# Altium schematic sheet OPTICS.SchDoc: XC7A3G-SFP
size A; Date: 9 AUG 2026; Engineer: Parsa Malekpour; Revision: 1.0.0; SheetNumber: 14; SheetTotal: 18
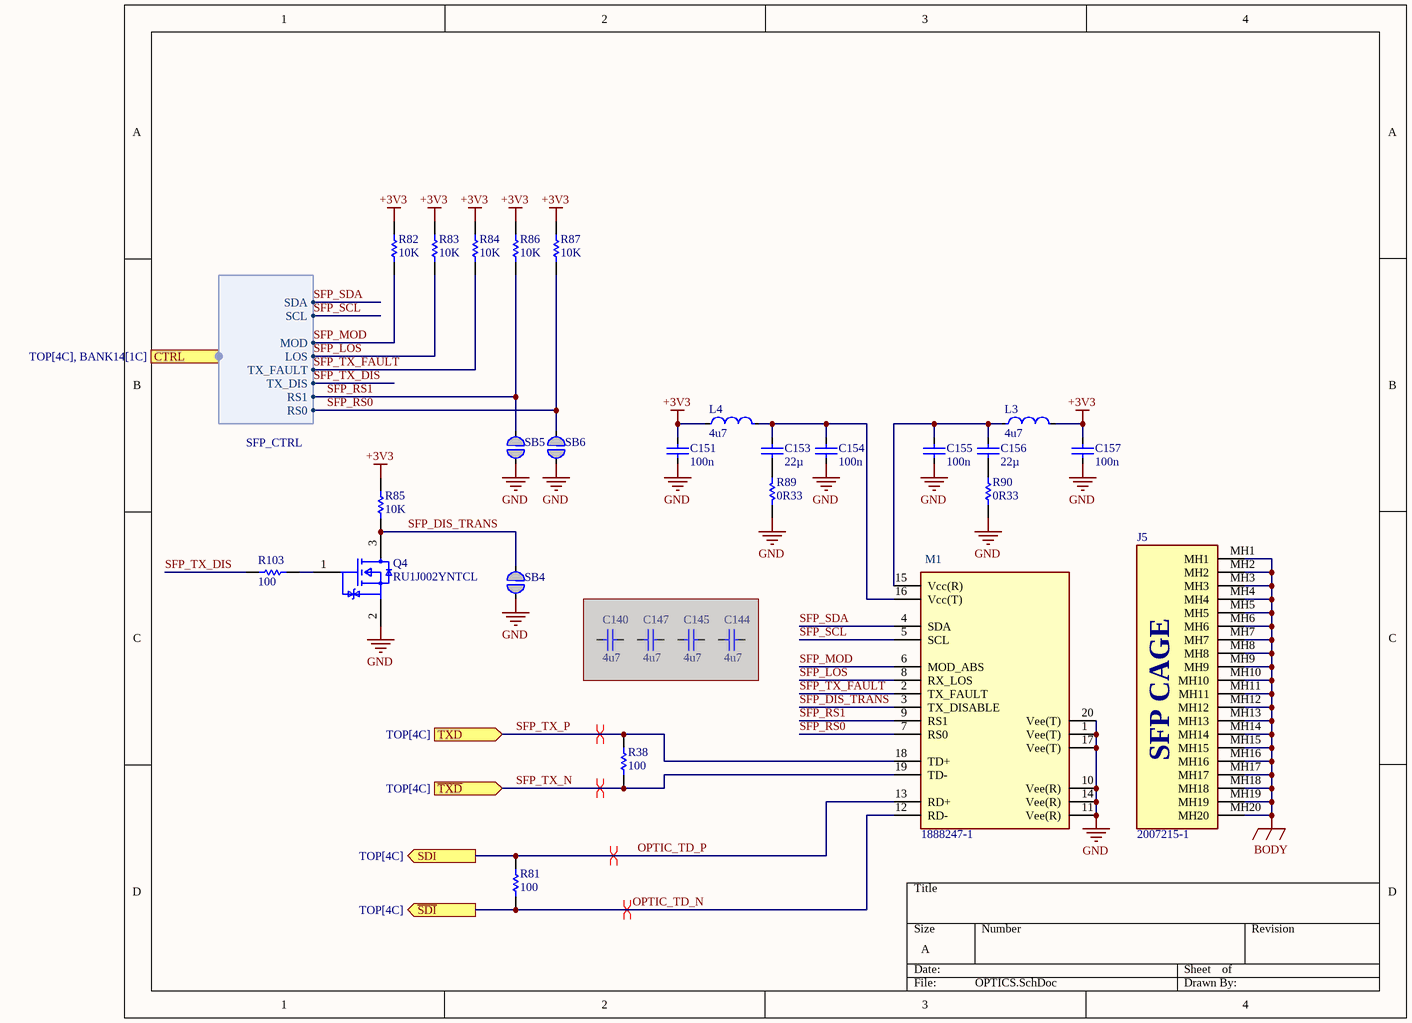
[diagram p0: OPTICS.SchDoc]

## Parts
C140  value 4u7  [FP-C1005-050-0_20-0_10-MFG]  (hidden comment: C1005X5R1A475K050BE)  (masked out: inside a compile mask, not in the netlist)
C144  value 4u7  [FP-C1005-050-0_20-0_10-MFG]  (hidden comment: C1005X5R1A475K050BE)  (masked out: inside a compile mask, not in the netlist)
C145  value 4u7  [FP-C1005-050-0_20-0_10-MFG]  (hidden comment: C1005X5R1A475K050BE)  (masked out: inside a compile mask, not in the netlist)
C147  value 4u7  [FP-C1005-050-0_20-0_10-MFG]  (hidden comment: C1005X5R1A475K050BE)  (masked out: inside a compile mask, not in the netlist)
C151  value 100n  [FP-C1005-050-0_05-IPC_C]  (hidden comment: C1005X7R1H104K050BB)
C153  value 22µ  [CAPC1608X100X20LL10]  (hidden comment: C1608X5R0J226M080AC)
C154  value 100n  [FP-C1005-050-0_05-IPC_C]  (hidden comment: C1005X7R1H104K050BB)
C155  value 100n  [FP-C1005-050-0_05-IPC_C]  (hidden comment: C1005X7R1H104K050BB)
C156  value 22µ  [CAPC1608X100X20LL10]  (hidden comment: C1608X5R0J226M080AC)
C157  value 100n  [FP-C1005-050-0_05-IPC_C]  (hidden comment: C1005X7R1H104K050BB)
J5  2007215-1  [2007215-1]
L3  value 4u7  [FP-DFE252012C-MFG]  (hidden comment: DFE252012P-4R7M=P2)
L4  value 4u7  [FP-DFE252012C-MFG]  (hidden comment: DFE252012P-4R7M=P2)
M1  1888247-1  [1888247-1]
Q4  RU1J002YNTCL  [FP-UMT3F-MFG]
R38  value 100  [RESC1005X40X25LL05T10]  (hidden comment: RC0402FR-07100RL)
R81  value 100  [RESC1005X40X25LL05T10]  (hidden comment: RC0402FR-07100RL)
R82  value 10K  [RESC1005X40X25LL05T10]  (hidden comment: RC0402FR-0710KL)
R83  value 10K  [RESC1005X40X25LL05T10]  (hidden comment: RC0402FR-0710KL)
R84  value 10K  [RESC1005X40X25LL05T10]  (hidden comment: RC0402FR-0710KL)
R85  value 10K  [RESC1005X40X25LL05T10]  (hidden comment: RC0402FR-0710KL)
R86  value 10K  [RESC1005X40X25LL05T10]  (hidden comment: RC0402FR-0710KL)
R87  value 10K  [RESC1005X40X25LL05T10]  (hidden comment: RC0402FR-0710KL)
R89  value 0R33  [RESC1608X55X30LL15T15]  (hidden comment: ERJ-3RQFR33V)
R90  value 0R33  [RESC1608X55X30LL15T15]  (hidden comment: ERJ-3RQFR33V)
R103  value 100  [RESC1005X40X25LL05T10]  (hidden comment: RC0402FR-07100RL)
SB4  Solderbridge  [Solderbridge]  (value not drawn)  (no BOM)
SB5  Solderbridge  [Solderbridge]  (value not drawn)  (no BOM)
SB6  Solderbridge  [Solderbridge]  (value not drawn)  (no BOM)

## Ports
CTRL (harness SFP_CTRL, see TOP[4C], BANK14[1C]), SDI (out, see TOP[4C]), TXD (in, see TOP[4C]), ~{SDI} (out, see TOP[4C]), ~{TXD} (in, see TOP[4C])

## Harnesses
SFP_CTRL: RS0, RS1, TX_DIS, TX_FAULT, LOS, MOD, SCL, SDA

## Nets
+3V3: C151.2 C157.2 L3.2 L4.2 R82.1 R83.1 R84.1 R85.2 R86.1 R87.1
BODY: J5.MH1 J5.MH2 J5.MH3 J5.MH4 J5.MH5 J5.MH6 J5.MH7 J5.MH8 J5.MH9 J5.MH10 J5.MH11 J5.MH12 J5.MH13 J5.MH14 J5.MH15 J5.MH16 J5.MH17 J5.MH18 J5.MH19 J5.MH20
GND: C151.1 C154.1 C155.1 C157.1 M1.1(Vee(T)) M1.10(Vee(R)) M1.11(Vee(R)) M1.14(Vee(R)) M1.17(Vee(T)) M1.20(Vee(T)) Q4.2(S) R89.2 R90.1 SB4.2 SB5.2 SB6.2
OPTIC_TD_N: M1.12(RD-) R81.2 ; port ~{SDI}
OPTIC_TD_P: M1.13(RD+) R81.1 ; port SDI
SFP_DIS_TRANS: M1.3(TX_DISABLE) Q4.3(D) R85.1 SB4.1
SFP_LOS: M1.8(RX_LOS) R83.2 ; port CTRL.LOS
SFP_MOD: M1.6(MOD_ABS) R82.2 ; port CTRL.MOD
SFP_RS0: M1.7(RS0) R87.2 SB6.1 ; port CTRL.RS0
SFP_RS1: M1.9(RS1) R86.2 SB5.1 ; port CTRL.RS1
SFP_SCL: M1.5(SCL) ; port CTRL.SCL
SFP_SDA: M1.4(SDA) ; port CTRL.SDA
SFP_TX_DIS: R103.1 ; port CTRL.TX_DIS
SFP_TX_FAULT: M1.2(TX_FAULT) R84.2 ; port CTRL.TX_FAULT
SFP_TX_N: M1.19(TD-) R38.1 ; port ~{TXD}
SFP_TX_P: M1.18(TD+) R38.2 ; port TXD
NetC153_1: C153.1 C154.2 L4.1 M1.16(Vcc(T))
NetC153_2: C153.2 R89.1
NetC155_2: C155.2 C156.1 L3.1 M1.15(Vcc(R))
NetC156_2: C156.2 R90.2
NetQ4_1: Q4.1(G) R103.2

## Layout directives
differential pair; differential pair class SDI100: OPTIC_TD_N, OPTIC_TD_P, SFP_TX_N, SFP_TX_P

## Notes on the sheet
- (near J5) SFP CAGE

## Library data of the parts
C140 C144 C145 C147 = C1005X5R1A475K050BE: MLCC  4.7UF ±20 10V X5R 0402; Tolerance: 10%; Max Operating Temperature: 85°C; Case Code (Metric): 1005; Voltage Rating: 10V; Packaging: Tape and Reel; Case/Package: 0402; Features: Soft Termination; Min Operating Temperature: -55°C; Mount: Surface Mount; Case Code (Imperial): 0402; RoHS Compliant: Yes; Part Number: C1005X5R1A475K050BE
C151 C154 C155 C157 = C1005X7R1H104K050BB: MLCC 100nF ±10% 50V X7R SMD 0402; Dielectric Material: Ceramic; Voltage: 50V; Min Operating Temperature: -55°C; Depth: 0.5mm; Radiation Hardening: No; RoHS Compliant: Yes; Voltage Rating (DC): 50V; Lead Free: Lead Free; Resistor Type: Ceramic; Height: 0.5mm; Dielectric: X7R; Thickness: 0.022inch; Case/Package: 0402; Case Code (Metric): 1005; Termination: SMD/SMT; Packaging: Tape and Reel; Max Operating Temperature: 125°C; Mount: Surface Mount; Package Quantity: 1; Width: 0.02inch; Weight: 2.3E-05oz; Voltage Rating: 50V; Tolerance: 10%; Construction: Flat; Case Code (Imperial): 0402; Length: 1mm; REACH SVHC: No SVHC; Series: C; Part Number: C1005X7R1H104K050BB
C153 C156 = C1608X5R0J226M080AC: MLCC 22 uF, ±20%, 6.3 V, -55 to 85 degC, 1608 (0603 Metric), RoHS, Tape and Reel; PCN Part Number: MLCCPartNumberChange30/Nov/2012; Manufacturer: TDK; Temperature Coefficient: X5R; Product Training Modules: CSeriesGeneralApplicationsSEAT,CCV,andTVCLDesignToolsGuidetoReplacinganElectrolyticCapacitorwithanMLCC; Other Names: 445-8028-1; Voltage - Rated: 6.3V; Design Resources: 20WNon-IsolatedBuckLEDDriverUsingPLLNK460KG; Online Catalog: CSeries,GeneralPurpose; Kits: 445-9003-KIT-ND-KITCAPCERHICAPMLCCSMD; Tolerance: ±20%; Series: C; Thickness (Max): 0.039"(1.00mm); Mounting Type: SurfaceMount,MLCC; Ratings: -; Datasheet Version: Mar-15; Package Reference: 603; Packaging: CutTape(CT); Features: -; Package / Case: 0603(1608Metric); Family: CeramicCapacitors; Lead Spacing: -; RoHS Information: RoHSCertificate-MLCC; Manufacturer URL: http://www.tdk.com/; Lead Style: -; Category: Capacitors; Applications: GeneralPurpose; Package Description: 2-Pin Surface Mount Device, Body 1.6 x 0.8 mm; Standard Package: 1; Datasheet URL: http://www.farnell.com/datasheets/1913358.pdf; Height - Seated (Max): -; Operating Temperature: -55degC~85degC; Size / Dimension: 0.063"Lx0.031"W(1.60mmx0.80mm)
L3 L4 = DFE252012P-4R7M=P2: Shielded Wirewound Inductor 4.7uH 20% 1400mA 0.2Ω 1008 (2520); Core Material: Ferrite; Test Frequency: 1MHz; DC Resistance (DCR): 200mR; Max DC Current: 1.4A; Current Rating: 2A; Case Code (Metric): 2520; Case Code (Imperial): 1008; Inductance: 4.7uH; Mount: Surface Mount; Packaging: Tape and Reel; Depth: 2mm; Length: 0.098inch; Case/Package: 1008; Max Operating Temperature: 125°C; Shielding: Shielded; Width: 0.079inch; Height - Seated (Max): 0.047inch; Tolerance: 20%; Min Operating Temperature: -40°C; Resistor Type: Wirewound
M1 = 1888247-1: SFP+, Connector, .8mm [.031in] Centerline, Power & Signal, Operating Temperature Range -55 – 85 °C [-67 – 185 °F], Data Rate (Max) 16Gb/sec; Manufacturer: TE Connectivity (TE; License: Apache-2.0; Author: Parsa Malekpor; Value: 1888247-1; Part Number: 1888247-1
Q4 = RU1J002YNTCL: MOSFET N-CH 50V 0.2A UMT3F; Manufacturer: Rohm; Drain To Source Resistance: 1.6Ω; Depletion Mode: False; Continuous Drain Current: 200mA; Pulse Drain Current: 800mA; Turn On Delay Time: 5ns; Threshold Vgs Max: 0.8V; Rthja Max: 833°C/W; Max Forward Diode Voltage: 1.2V; Max Junction Temp: +150°C; Standoff Height: 0mm; Input Capacitace At Vds: 26pF @ 10V; Number Of Channels: 1; Power Dissipation: 150mW; Gate To Source Voltage: 8V; Turn Off Delay Time: 17ns; Threshold Vgs Min: 0.3V; Lead Free: Yes; Device Class L3: MOSFETs; Drain To Source Voltage: 50V; ComponentLink2URL: https://d1d2qsbl8m0m72.cloudfront.net/en/products/databook/datasheet/discrete/transistor/mosfet/ru1j002yn-e.pdf; RoHS: TRUE; Device Class L2: Transistors; Mouser Description: MOSFET 0.9V Drive Nch MOSFET; Category: Trans; Octopart: https://octopart.com/ru1j002yntcl-rohm-47197697; Temperature: to +150°C; Height: 1.05mm; Number Of N Channels: 1; Package: UMT3F; ComponentLink2Description: Datasheet; Automotive: No; Drain To Source Breakdown Voltage: 50V; Device Class L1: Discrete Semiconductors; Digikey Description: MOSFET N-CH 50V 0.2A UMT3F; Manufacturer Part Number: RU1J002YNTCL; Temperature Range High: +150°C
R38 R81 R103 = RC0402FR-07100RL: Manufacturer: Yageo / Phycomp; Part Number: RC0402FR-07100RL
R82-R87 = RC0402FR-0710KL: Manufacturer: Yageo / Phycomp; Part Number: RC0402FR-0710KL
R89 R90 = ERJ-3RQFR33V: Manufacturer: Panasonic; Part Number: ERJ-3RQFR33V
SB4-SB6 = Solderbridge_1: Manufacturer: N.A.; Pad Count: 2; Part Number: Solderbridge; Manufacturer Part Number: N.A.; LatestRevisionDate: 2009-12-14; Published: 2009-12-14; Value: Solderbridge; Note: N.A.; Artikkelnr Noca: N.A.; Footprint Doc: Solderbridge; Part number IPS: N.A.; ComponentLink1URL: N.A.; ComponentLink1Description: Datasheet; ComponentLink2URL: N.A.; ComponentLink2Description: Supplier link; HelpURL: N.A.; Supplier 1: N.A.; Supplier Part Number 1: N.A.; Supplier 2: N.A.; Supplier Part Number 2: N.A.; Component Class: Connectors; PartId: 100500458